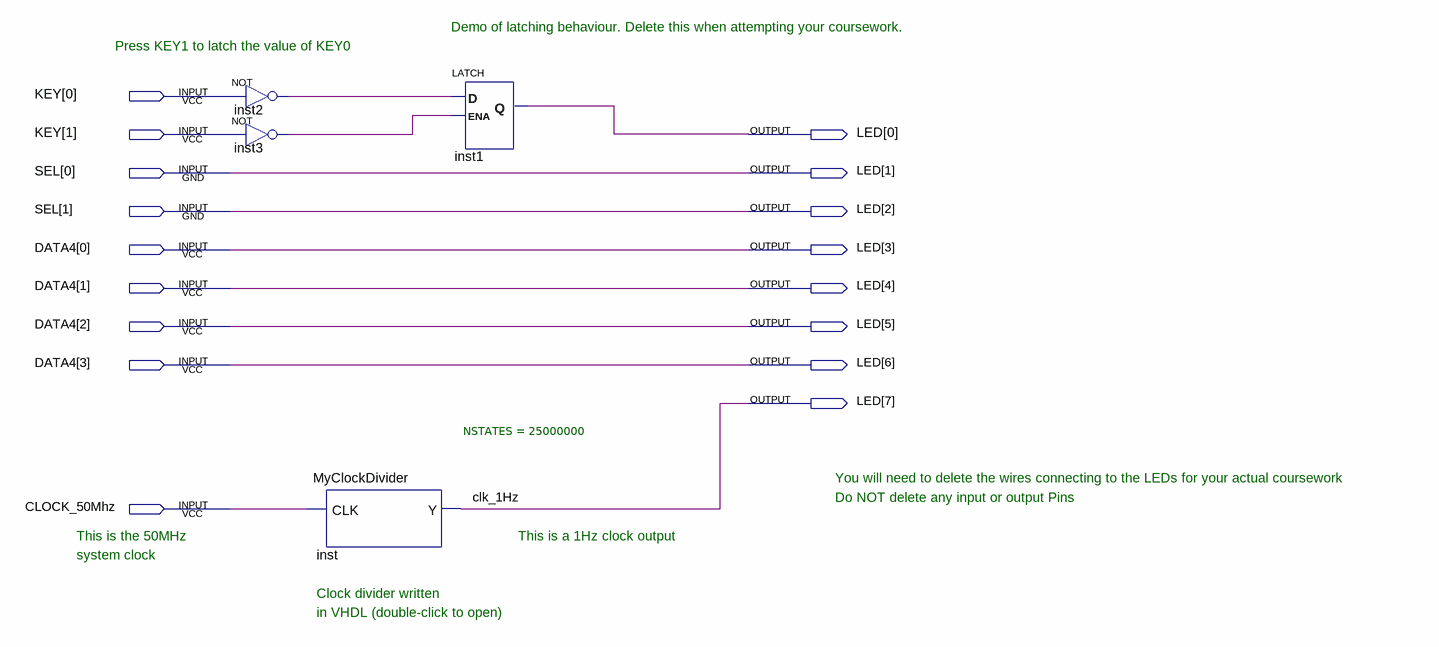
[diagram p0: schematic sheet]
// Quartus schematic Template_2019.bdf as structural Verilog: 4 symbols, 17 pins
module Template_2019 (
  input  [1:0] KEY,
  input  [1:0] SEL,
  input  [3:0] DATA4,
  input  CLOCK_50Mhz,
  output [7:0] LED
);

  wire inst2_out, inst3_out;

  not inst2 (inst2_out, KEY[0]);
  not inst3 (inst3_out, KEY[1]);
  MyClockDivider #(.NSTATES(25000000)) inst (.CLK(CLOCK_50Mhz), .Y(LED[7]));
  LATCH inst1 (.D(inst2_out), .ENA(inst3_out), .Q(LED[0]));

  assign LED[6:1] = {DATA4, SEL};

  // Other names for the same wires on the sheet: clk_1Hz = LED[7]

  // Notes on the sheet:
  //   Demo of latching behaviour. Delete this when attempting your coursework.
  //   Press KEY1 to latch the value of KEY0
  //   You will need to delete the wires connecting to the LEDs for your actual coursework
  //   Do NOT delete any input or output Pins
  //   This is the 50MHz
  //   This is a 1Hz clock output
  //   system clock
  //   Clock divider written
  //   in VHDL (double-click to open)
endmodule
